# EAGLE schematic ce2_redraw (EAGLE 9.1.3)
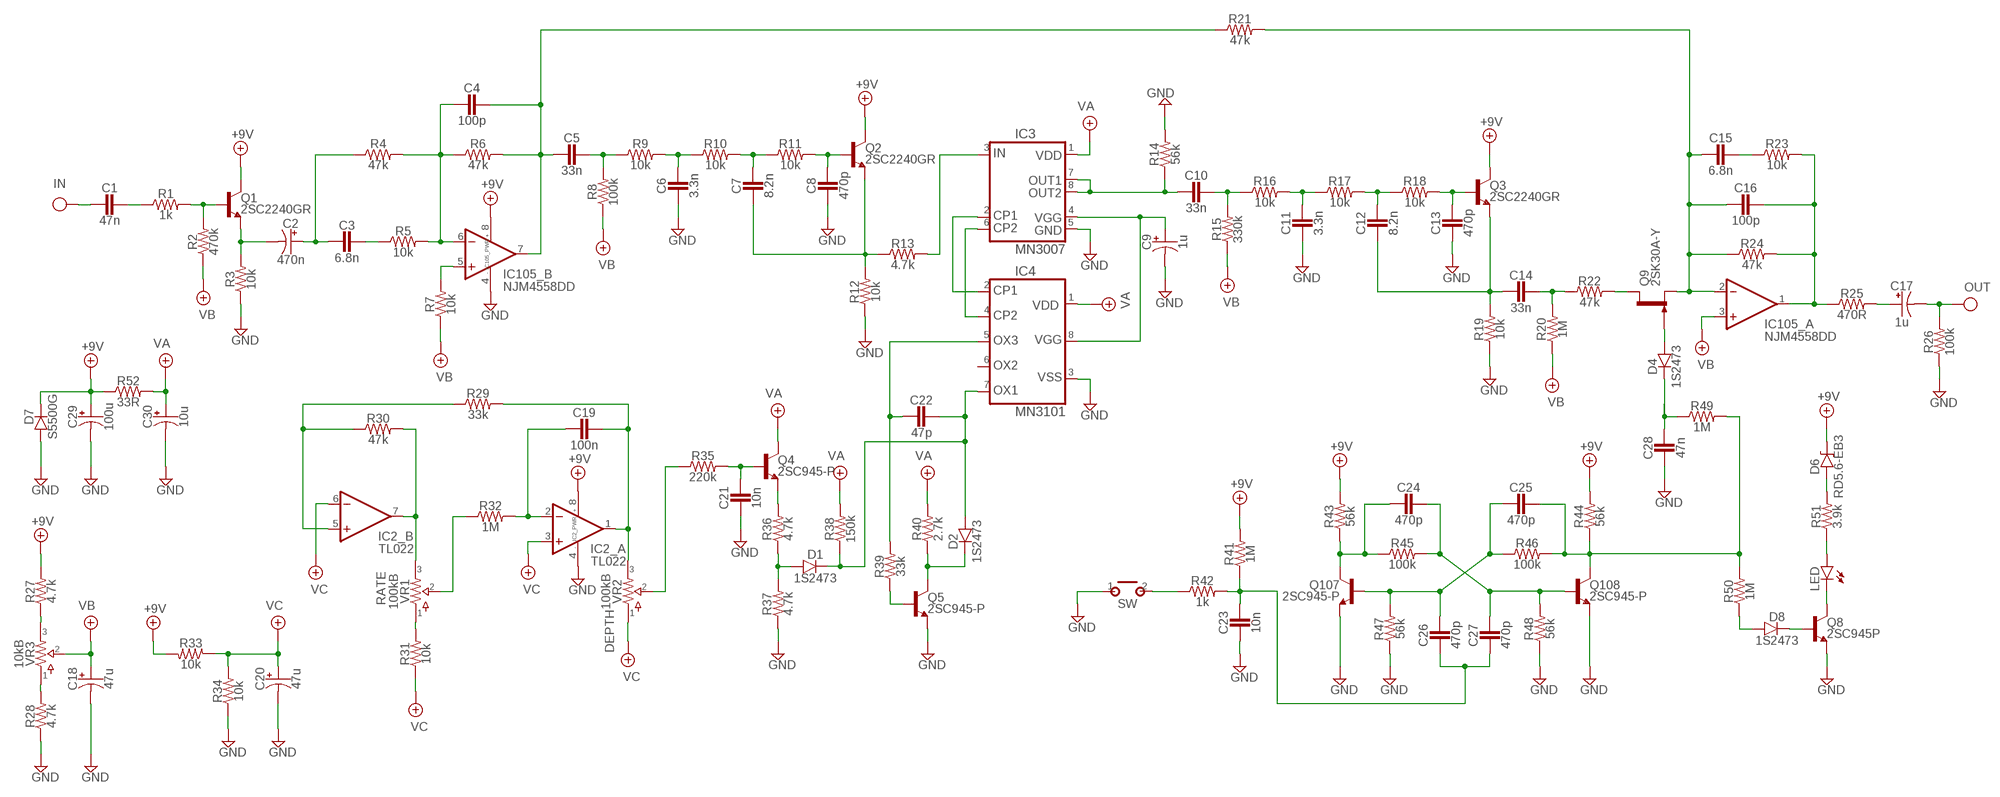
[diagram p0: schematic, sheet 1]

## Parts
C1  47n  CER/FILMBOX.1  [BOX_SMALL]
C2  470n  0400  [040_020]
C3  6.8n  CER/FILMBOX.1  [BOX_SMALL]
C4  100p  CER/FILMBOX.1  [BOX_SMALL]
C5  33n  CER/FILMBOX.1  [BOX_SMALL]
C6  3.3n  CER/FILMBOX.1  [BOX_SMALL]
C7  8.2n  CER/FILMBOX.1  [BOX_SMALL]
C8  470p  CER/FILMBOX.1  [BOX_SMALL]
C9  1u  0400  [040_020]
C10  33n  CER/FILMBOX.1  [BOX_SMALL]
C11  3.3n  CER/FILMBOX.1  [BOX_SMALL]
C12  8.2n  CER/FILMBOX.1  [BOX_SMALL]
C13  470p  CER/FILMBOX.1  [BOX_SMALL]
C14  33n  CER/FILMBOX.1  [BOX_SMALL]
C15  6.8n  CER/FILMBOX.1  [BOX_SMALL]
C16  100p  CER/FILMBOX.1  [BOX_SMALL]
C17  1u  0400  [040_020]
C18  47u  0400  [040_020]
C19  100n  CER/FILMBOX.1  [BOX_SMALL]
C20  47u  0400  [040_020]
C21  10n  CER/FILMBOX.1  [BOX_SMALL]
C22  47p  CER/FILMBOX.1  [BOX_SMALL]
C23  10n  CER/FILMBOX.1  [BOX_SMALL]
C24  470p  CER/FILMBOX.1  [BOX_SMALL]
C25  470p  CER/FILMBOX.1  [BOX_SMALL]
C26  470p  CER/FILMBOX.1  [BOX_SMALL]
C27  470p  CER/FILMBOX.1  [BOX_SMALL]
C28  47n  CER/FILMBOX.1  [BOX_SMALL]
C29  100u  0400  [040_020]
C30  10u  0400  [040_020]
D1  1S2473  DO35.2  [DO35-2]
D2  1S2473  DO35.2  [DO35-2]
D4  1S2473  DO35.2  [DO35-2]
D6  RD5.6-EB3  ZENER.1  [DO41-1]
D7  S5500G  DO35.2  [DO35-2]
D8  1S2473  DO35.2  [DO35-2]
IC2  TL022  DUALTH  [DIL0]
IC3  MN3007  BL3208  [DIL0]
IC4  MN3101  CLOCK  [DIL8]
IC105  NJM4558DD  DUALTH  [DIL0]
LED  LED  [3MM_D]
Q1  2SC2240GR  2SC828A  [TO92-]
Q2  2SC2240GR  2SC828A  [TO92-]
Q3  2SC2240GR  2SC828A  [TO92-]
Q4  2SC945-P  2SC828A  [TO92-]
Q5  2SC945-P  2SC828A  [TO92-]
Q8  2SC945P  2SC828A  [TO92-]
Q9  2SK30A-Y  2N5457  [TO92-]
Q107  2SC945-P  2SC828A  [TO92-]
Q108  2SC945-P  2SC828A  [TO92-]
R1  1k  R_.3B  [R0207/3]
R2  470k  R_.3B  [R0207/3]
R3  10k  R_.3B  [R0207/3]
R4  47k  R_.3B  [R0207/3]
R5  10k  R_.3B  [R0207/3]
R6  47k  R_.3B  [R0207/3]
R7  10k  R_.3B  [R0207/3]
R8  100k  R_.3B  [R0207/3]
R9  10k  R_.3B  [R0207/3]
R10  10k  R_.3B  [R0207/3]
R11  10k  R_.3B  [R0207/3]
R12  10k  R_.3B  [R0207/3]
R13  4.7k  R_.3B  [R0207/3]
R14  56k  R_.3B  [R0207/3]
R15  330k  R_.3B  [R0207/3]
R16  10k  R_.3B  [R0207/3]
R17  10k  R_.3B  [R0207/3]
R18  10k  R_.3B  [R0207/3]
R19  10k  R_.3B  [R0207/3]
R20  1M  R_.3B  [R0207/3]
R21  47k  R_.3B  [R0207/3]
R22  47k  R_.3B  [R0207/3]
R23  10k  R_.3B  [R0207/3]
R24  47k  R_.3B  [R0207/3]
R25  470R  R_.3B  [R0207/3]
R26  100k  R_.3B  [R0207/3]
R27  4.7k  R_.3B  [R0207/3]
R28  4.7k  R_.3B  [R0207/3]
R29  33k  R_.3B  [R0207/3]
R30  47k  R_.3B  [R0207/3]
R31  10k  R_.3B  [R0207/3]
R32  1M  R_.3B  [R0207/3]
R33  10k  R_.3B  [R0207/3]
R34  10k  R_.3B  [R0207/3]
R35  220k  R_.3B  [R0207/3]
R36  4.7k  R_.3B  [R0207/3]
R37  4.7k  R_.3B  [R0207/3]
R38  150k  R_.3B  [R0207/3]
R39  33k  R_.3B  [R0207/3]
R40  2.7k  R_.3B  [R0207/3]
R41  1M  R_.3B  [R0207/3]
R42  1k  R_.3B  [R0207/3]
R43  56k  R_.3B  [R0207/3]
R44  56k  R_.3B  [R0207/3]
R45  100k  R_.3B  [R0207/3]
R46  100k  R_.3B  [R0207/3]
R47  56k  R_.3B  [R0207/3]
R48  56k  R_.3B  [R0207/3]
R49  1M  R_.3B  [R0207/3]
R50  1M  R_.3B  [R0207/3]
R51  3.9k  R_.3B  [R0207/3]
R52  33R  R_.3B  [R0207/3]
SW  MOMENTARY  [SPST]
VR1  100kB  POTS16MM  [16MM]
VR2  100kB  POTS16MM  [16MM]
VR3  10kB  POTS16MM  [16MM]

## Nets
+9V: C29.+ D6.C D7.C IC2.8(_PWR:V+) IC105.8(_PWR:V+) Q1.2(C) Q2.2(C) Q3.2(C) R27.2 R33.2 R41.2 R43.2 R44.2 R52.1
GND: C6.2 C8.2 C9.- C11.2 C13.2 C18.- C20.- C21.2 C23.2 C28.2 C29.- C30.- D7.A IC2.4(_PWR:V-) IC3.5 IC4.3 IC105.4(_PWR:V-) Q5.3(E) Q8.3(E) Q107.3(E) Q108.3(E) R3.1 R12.1 R14.2 R19.1 R26.1 R28.1 R34.1 R37.1 R47.1 R48.1 SW.1(P)
IN: C1.2
N$2: R28.2 VR3.1
N$3: C1.1 R1.1
N$4: Q1.1(B) R1.2 R2.2
N$5: C2.+ C3.2 R4.1
N$6: R27.1 VR3.3
N$7: C2.- Q1.3(E) R3.2
N$8: C3.1 R5.1
N$9: C4.2 IC105.6(_B:-IN) R4.2 R5.2 R6.1
N$10: IC105.5(_B:+IN) R7.2
N$11: C5.1 R8.2 R9.1
N$12: C4.1 C5.2 IC105.7(_B:OUT) R6.2 R21.1
N$13: C14.1 R20.2 R22.1
N$14: C6.1 R9.2 R10.1
N$15: C7.1 R10.2 R11.1
N$16: C7.2 Q2.3(E) R12.2 R13.1
N$17: C8.1 Q2.1(B) R11.2
N$18: C9.+ IC3.4 IC4.8
N$19: D2.C Q5.2(C) R40.1
N$20: Q9.3(D) R22.2
N$21: C22.2 IC4.5 R39.2
N$22: Q5.1(B) R39.1
N$23: C10.2 IC3.7 IC3.8 R14.1
N$24: D1.A R36.1 R37.2
N$25: IC3.3 R13.2
N$26: IC3.2 IC4.2
N$27: C25.1 Q108.2(C) R44.1 R46.2 R49.2 R50.2
N$28: C24.2 Q107.2(C) R43.1 R45.1
N$29: D8.A R50.1
N$30: D8.C Q8.1(B)
N$31: C17.+ R25.2
N$32: C25.2 C26.1 Q107.1(B) R46.1 R47.2
N$33: IC3.6 IC4.4
N$34: C24.1 C27.1 Q108.1(B) R45.2 R48.2
N$35: IC2.7(_B:OUT) R30.2 VR1.3
N$36: IC2.5(_B:+IN) R29.1 R30.1
N$37: C10.1 R15.2 R16.1
N$38: R31.2 VR1.1
N$39: R32.1 VR1.2
N$40: C19.2 IC2.2(_A:-IN) R32.2
N$41: LED.P$1(C) Q8.2(C)
N$42: C19.1 IC2.1(_A:OUT) R29.2 VR2.3
N$43: C11.1 R16.2 R17.1
N$44: R35.1 VR2.2
N$45: C21.1 Q4.1(B) R35.2
N$46: C23.1 C26.2 C27.2 R41.1 R42.2
N$47: Q4.3(E) R36.2
N$48: C12.1 R17.2 R18.1
N$49: C13.1 Q3.1(B) R18.2
N$50: C12.2 C14.2 Q3.3(E) R19.2
N$51: LED.ANODE(A) R51.1
N$52: D6.A R51.2
N$53: C16.1 IC105.1(_A:OUT) R23.2 R24.2 R25.1
N$54: C15.1 R23.1
N$56: C15.2 C16.2 IC105.2(_A:-IN) Q9.2(S) R21.2 R24.1
N$60: D4.A Q9.1(G)
N$61: C28.1 D4.C R49.1
N$70: C22.1 D1.C D2.A IC4.7 R38.1
N$77: R42.1 SW.2(S)
OUT: C17.- R26.2
VA: C30.+ IC3.1 IC4.1 Q4.2(C) R38.2 R40.2 R52.2
VB: C18.+ IC105.3(_A:+IN) R2.1 R7.1 R8.1 R15.1 R20.1 VR3.2
VC: C20.+ IC2.3(_A:+IN) IC2.6(_B:-IN) R31.1 R33.1 R34.2 VR2.1
Unconnected: IC4.6

## Notes on the sheet
- RATE
- DEPTH

## Library data of the parts
C1 C3-C8 C10-C16 C19 C21-C28 = pedals-capacitors-film:CER/FILM: 47 - 120pF Xicon Ceramic Disc 2.5mm lead spacing
C2 C9 C17 C18 C20 C29 C30 = pedals-capacitors-elec:040
D1 D2 D4 D7 D8 = pedals-diodes:DO35: DO-35 Package Diodes: 1N914
D6 = pedals-diodes:ZENER
IC2 IC105 = pedals-integrated circuits:DUAL: OP AMP
IC3 = pedals-integrated circuits:BL3208
IC4 = pedals-integrated circuits:CLOCK
LED = pedals-diodes:LED
Q1-Q5 Q8 Q107 Q108 = pedals-transistors:2SC828A
Q9 = pedals-transistors:2N5457: N-CHANNEL JFET
R1-R52 = pedals-resistors:R_
SW = pedals-switches:MOMENTARY
VR1-VR3 = pedals-potentiometers:POTS